# EAGLE design laminadora (EAGLE 9.6.2)

## Sheet 1 of 4
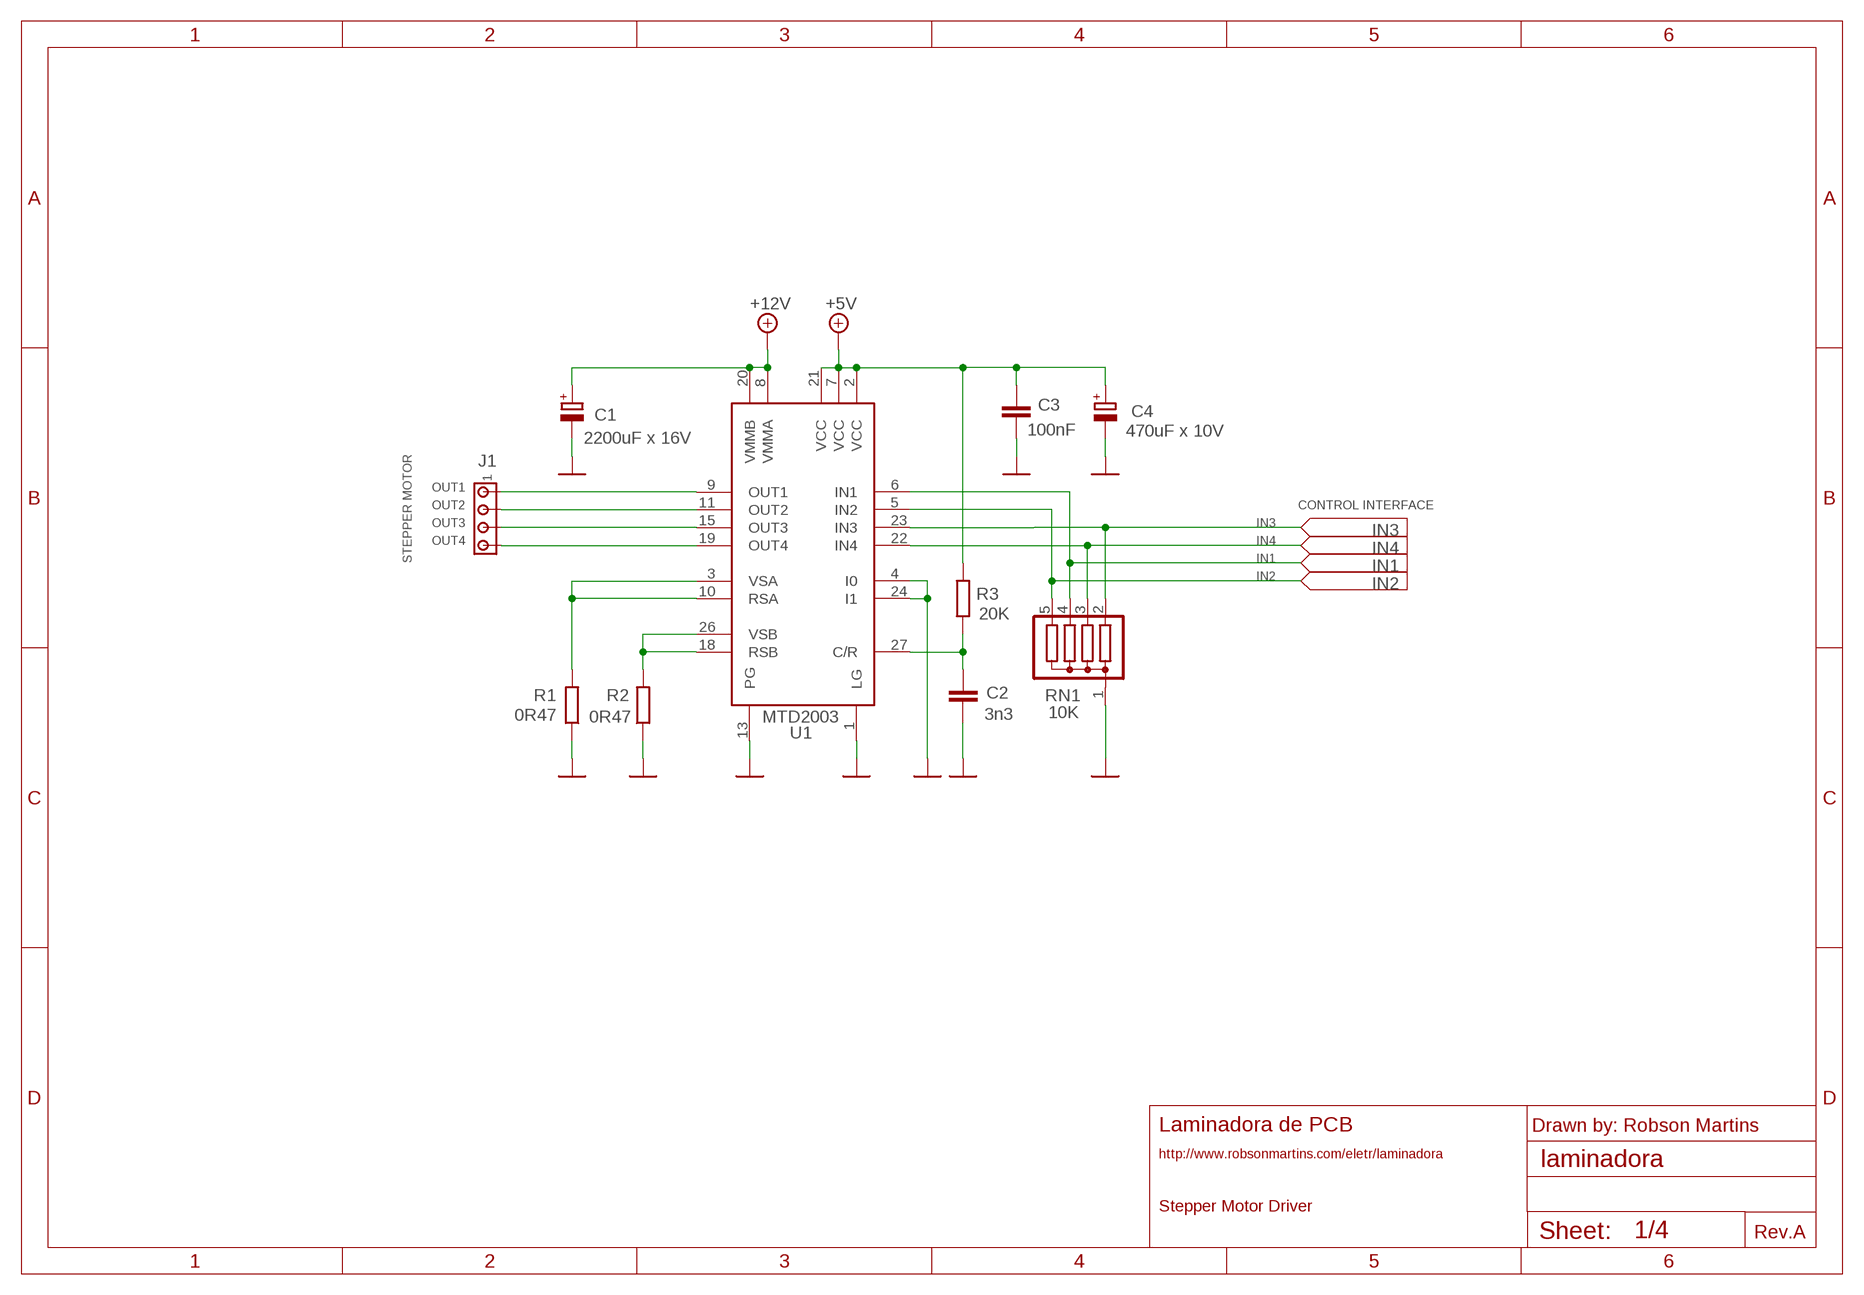
[diagram p0: schematic, sheet 1]

### Parts
C1  2200uF x 16V  CPOL-EUE5-13  [E5-13]
C2  3n3  C-EU050-025X075  [C050-025X075]
C3  100nF  C-EU050-025X075  [C050-025X075]
C4  470uF x 10V  CPOL-EUE5-8.5  [E5-8,5]
J1  A20-04  [A20-04]
R1  0R47  R-EU_0309/12  [0309/12]
R2  0R47  R-EU_0309/12  [0309/12]
R3  20K  R-EU_0207/10  [0207/10]
RN1  10K  G04R  [SIL5]
U1  MTD2003  MTD2003ZIP27SINK  [ZIP27SINK]

### Nets
+5V: C3.1 C4.+ R3.2 U1.2(VCC) U1.7(VCC) U1.21(VCC) ; also sheet 2,3,4
+12V: C1.+ U1.8(VMMA) U1.20(VMMB) ; also sheet 4
CR: C2.1 R3.1 U1.27(C/R)
GND: C1.- C2.2 C3.2 C4.- R1.1 R2.1 RN1.1 U1.1(LG) U1.4(I0) U1.13(PG) U1.24(I1) ; also sheet 2,3,4
IN1: RN1.4 U1.6(IN1) ; also sheet 2
IN2: RN1.5 U1.5(IN2) ; also sheet 2
IN3: RN1.2 U1.23(IN3) ; also sheet 2
IN4: RN1.3 U1.22(IN4) ; also sheet 2
OUT1: J1.1 U1.9(OUT1)
OUT2: J1.2 U1.11(OUT2)
OUT3: J1.3 U1.15(OUT3)
OUT4: J1.4 U1.19(OUT4)
SA: R1.2 U1.3(VSA) U1.10(RSA)
SB: R2.2 U1.18(RSB) U1.26(VSB)

### Notes on the sheet
- CONTROL INTERFACE
- STEPPER MOTOR
- Laminadora de PCB | Drawn by: Robson Martins
- http://www.robsonmartins.com/eletr/laminadora
- Stepper Motor Driver
- Rev.A

## Sheet 2 of 4
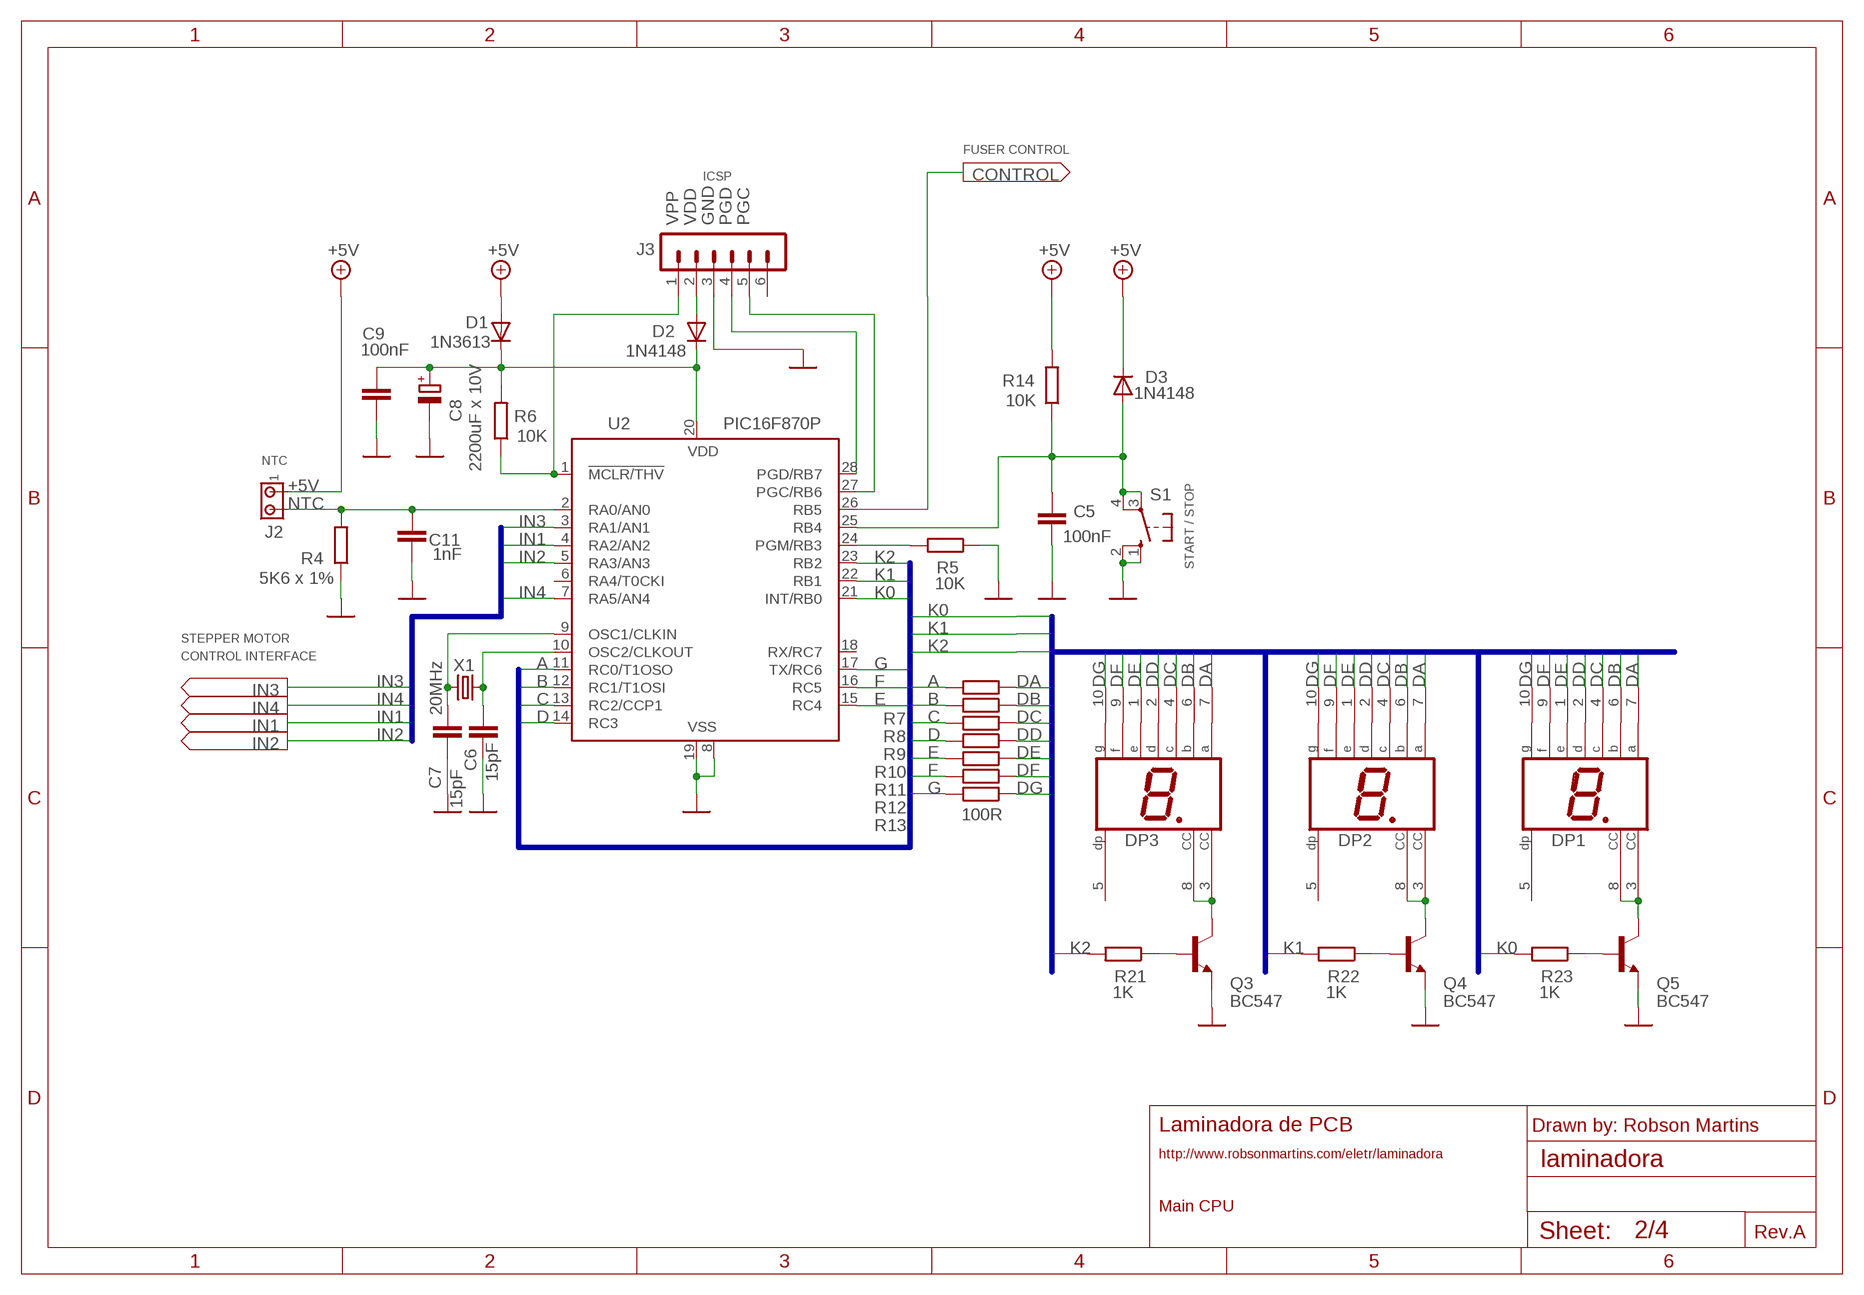
[diagram p1: schematic, sheet 2]

### Parts
C5  100nF  C-EU050-025X075  [C050-025X075]
C6  15pF  C-EU025-025X050  [C025-025X050]
C7  15pF  C-EU025-025X050  [C025-025X050]
C8  2200uF x 10V  CPOL-EUE5-13  [E5-13]
C9  100nF  C-EU050-025X075  [C050-025X075]
C11  1nF  C-EU025-025X050  [C025-025X050]
D1  1N3613  1N4148DO35-7  [DO35-7]
D2  1N4148  1N4148DO35-7  [DO35-7]
D3  1N4148  1N4148DO35-7  [DO35-7]
DP1  HD-H103  [HDSP-M]
DP2  HD-H103  [HDSP-M]
DP3  HD-H103  [HDSP-M]
J2  A20-04  MTA02-100  [10X02MTA]
J3  MA06-1  [MA06-1]
Q3  BC547  [TO92]
Q4  BC547  [TO92]
Q5  BC547  [TO92]
R4  5K6 x 1%  R-EU_0207/10  [0207/10]
R5  10K  R-EU_0207/10  [0207/10]
R6  10K  R-EU_0207/10  [0207/10]
R7  100R  R-EU_0207/10  [0207/10]
R8  100R  R-EU_0207/10  [0207/10]
R9  100R  R-EU_0207/10  [0207/10]
R10  100R  R-EU_0207/10  [0207/10]
R11  100R  R-EU_0207/10  [0207/10]
R12  100R  R-EU_0207/10  [0207/10]
R13  100R  R-EU_0207/10  [0207/10]
R14  10K  R-EU_0207/10  [0207/10]
R21  1K  R-EU_0207/10  [0207/10]
R22  1K  R-EU_0207/10  [0207/10]
R23  1K  R-EU_0207/10  [0207/10]
S1  10-XX  [B3F-10XX]
U2  PIC16F870P  [DIL28-3]
X1  20MHz  CRYSTALHC49U-V  [HC49U-V]

### Nets
+5V: D1.A D3.C J2.1 R14.2 ; also sheet 1,3,4
A: R7.2 U2.11(RC0/T1OSO)
B: R8.2 U2.12(RC1/T1OSI)
C: R9.2 U2.13(RC2/CCP1)
CONTROL: U2.26(RB5) ; also sheet 3
D: R10.2 U2.14(RC3)
DA: DP1.7(A) DP2.7(A) DP3.7(A) R7.1
DB: DP1.6(B) DP2.6(B) DP3.6(B) R8.1
DC: DP1.4(C) DP2.4(C) DP3.4(C) R9.1
DD: DP1.2(D) DP2.2(D) DP3.2(D) R10.1
DE: DP1.1(E) DP2.1(E) DP3.1(E) R11.1
DF: DP1.9(F) DP2.9(F) DP3.9(F) R12.1
DG: DP1.10(G) DP2.10(G) DP3.10(G) R13.1
E: R11.2 U2.15(RC4)
F: R12.2 U2.16(RC5)
G: R13.2 U2.17(TX/RC6)
GND: C5.2 C6.2 C7.2 C8.- C9.2 C11.2 J3.3 Q3.1(E) Q4.1(E) Q5.1(E) R4.1 R5.1 S1.1(S) S1.2(S1) U2.8(VSS) U2.19(VSS) ; also sheet 1,3,4
IN1: U2.4(RA2/AN2) ; also sheet 1
IN2: U2.5(RA3/AN3) ; also sheet 1
IN3: U2.3(RA1/AN1) ; also sheet 1
IN4: U2.7(RA5/AN4) ; also sheet 1
K0: R23.2 U2.21(INT/RB0)
K1: R22.2 U2.22(RB1)
K2: R21.2 U2.23(RB2)
N$1: DP3.3(CC) DP3.8(CC) Q3.3(C)
N$2: DP2.3(CC) DP2.8(CC) Q4.3(C)
N$3: DP1.3(CC) DP1.8(CC) Q5.3(C)
N$5: Q5.2(B) R23.1
N$6: Q4.2(B) R22.1
N$9: Q3.2(B) R21.1
NTC: C11.1 J2.2 R4.2 U2.2(RA0/AN0)
PGC: J3.5 U2.27(PGC/RB6)
PGD: J3.4 U2.28(PGD/RB7)
PGM: R5.2 U2.24(PGM/RB3)
START_STOP: C5.1 D3.A R14.1 S1.3(P) S1.4(P1) U2.25(RB4)
VDD: D2.A J3.2
VDD_MICRO: C8.+ C9.1 D1.C D2.C R6.2 U2.20(VDD)
VPP: J3.1 R6.1 U2.1(!MCLR/THV)
XTAL1: C7.1 U2.9(OSC1/CLKIN) X1.2
XTAL2: C6.1 U2.10(OSC2/CLKOUT) X1.1
Unconnected: DP1.5(DP) DP2.5(DP) DP3.5(DP) J3.6 U2.6(RA4/T0CKI) U2.18(RX/RC7)

### Buses
BUS_MICRO_DP
BUS_DP
BUS_MICRO_SM

### Notes on the sheet
- FUSER CONTROL
- ICSP
- NTC
- START / STOP
- STEPPER MOTOR
- CONTROL INTERFACE
- Laminadora de PCB | Drawn by: Robson Martins
- http://www.robsonmartins.com/eletr/laminadora
- Main CPU
- Rev.A

## Sheet 3 of 4
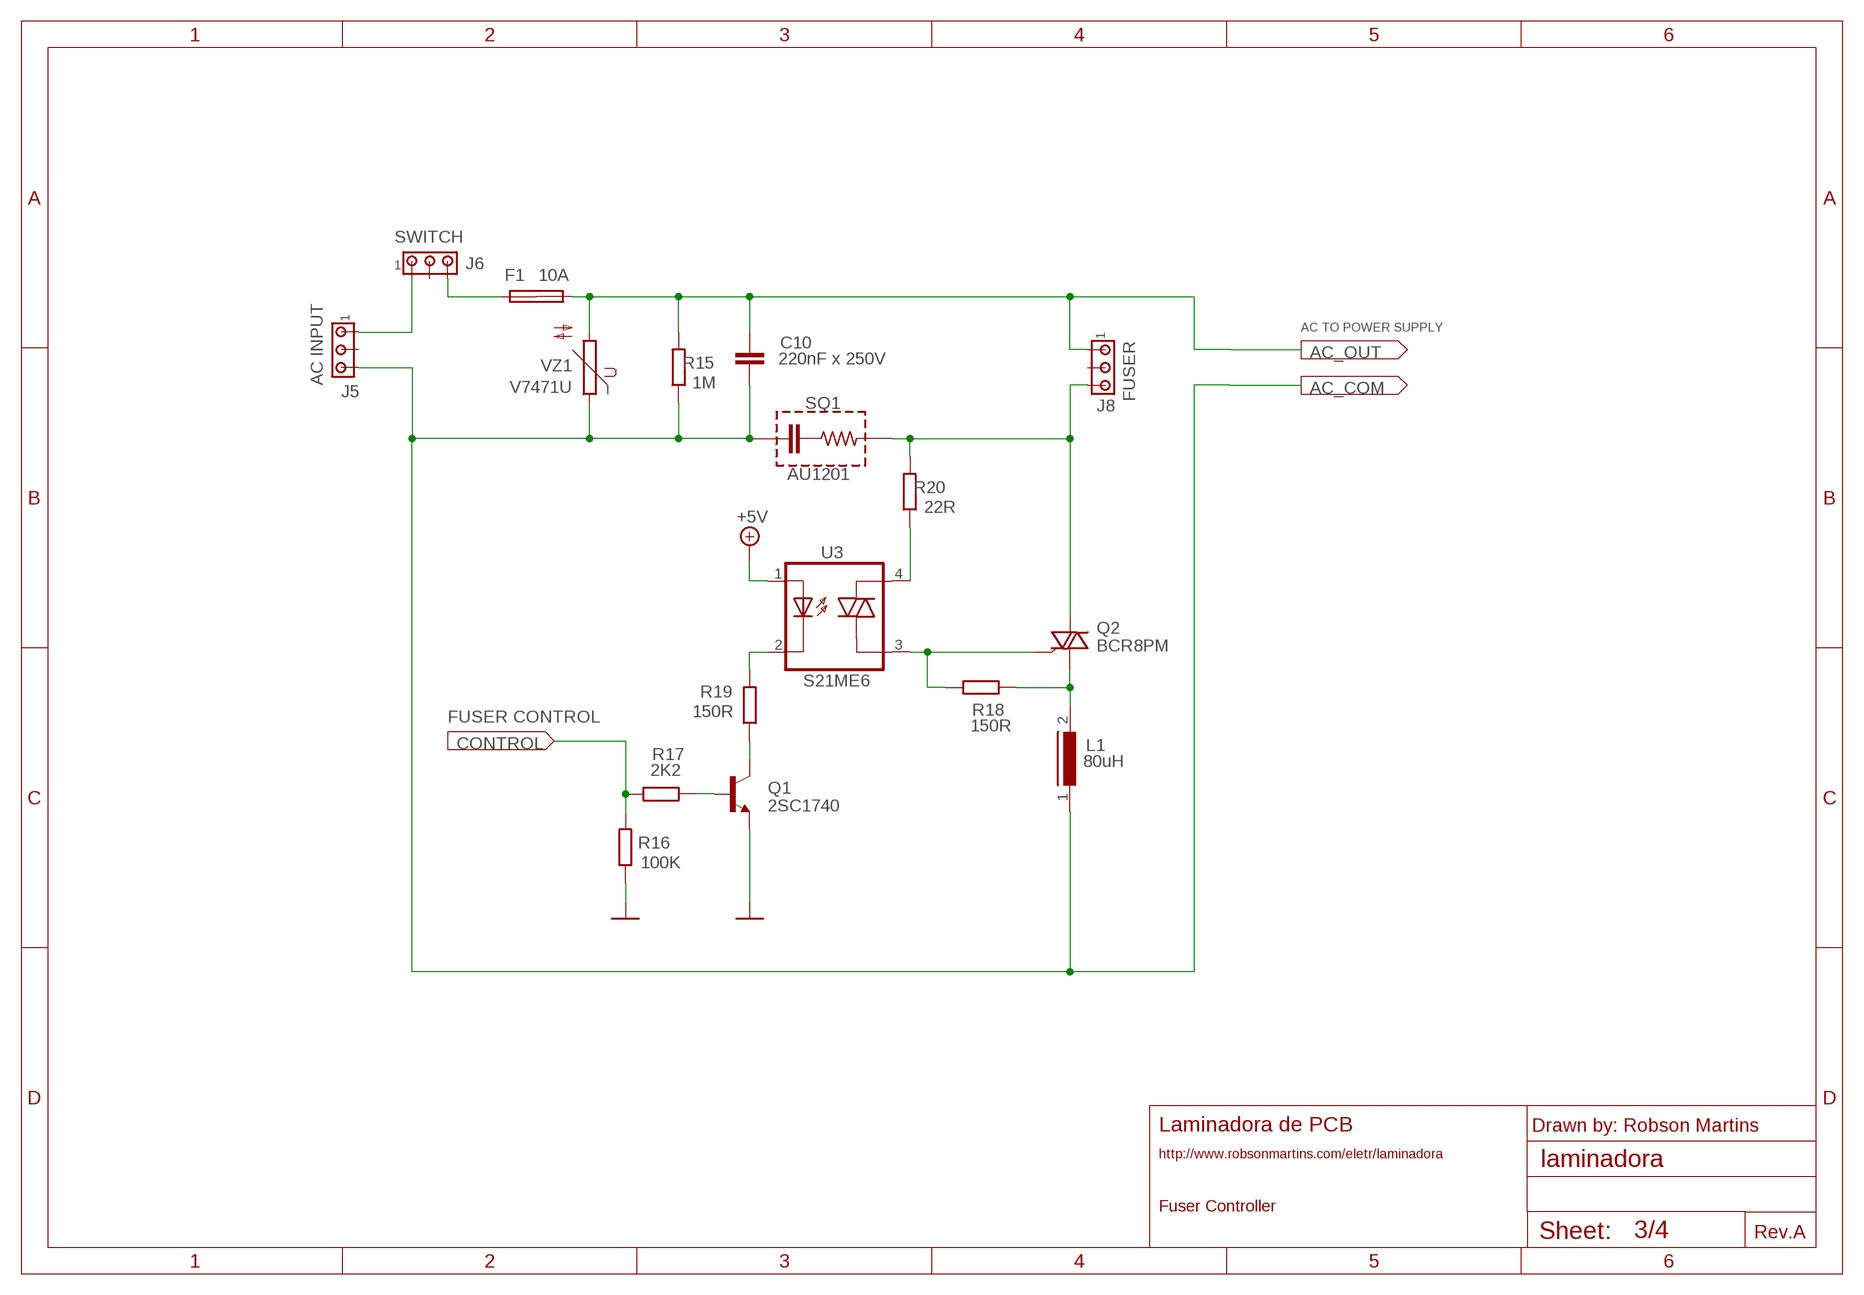
[diagram p2: schematic, sheet 3]

### Parts
C10  220nF x 250V  C-EU225-108X268  [C225-108X268]
F1  10A  SHK20L  [SHK20L]
J5  794681-2  MTA03-156  [1X3MTA]
J6  794681-2  MTA03-156  [1X3MTA]
J8  794681-2  MTA03-156  [1X3MTA]
L1  80uH  A26GFC  [A26GFC]
Q1  2SC1740  [TO92-ECB]
Q2  BCR8PM  BCR8PMTO220BVSINK  [TO220BVSINK]
R15  1M  R-EU_0207/10  [0207/10]
R16  100K  R-EU_0207/10  [0207/10]
R17  2K2  R-EU_0207/10  [0207/10]
R18  150R  R-EU_0207/10  [0207/10]
R19  150R  R-EU_0207/10  [0207/10]
R20  22R  R-EU_0207/10  [0207/10]
SQ1  AU1201  [AU]
U3  S21ME6  [DIL4]
VZ1  V7471U  S05K17  [S05K17]

### Nets
+5V: U3.1(A) ; also sheet 1,2,4
AC_COM: C10.2 J5.3 L1.1 R15.1 SQ1.1 VZ1.1 ; also sheet 4
AC_FUSER: J8.3 Q2.T2(A2) R20.2 SQ1.2
AC_IN: J5.1 J6.1
AC_OUT: C10.1 F1.2A J8.1 R15.2 VZ1.2 ; also sheet 4
AC_SW: F1.1A J6.3
CONTROL: R16.2 R17.2 ; also sheet 2
GATE: Q2.G R18.2 U3.3(A1)
GND: Q1.E R16.1 ; also sheet 1,2,4
N$4: R20.1 U3.4(A2)
N$7: L1.2 Q2.T1(A1) R18.1
N$8: R19.2 U3.2(C)
N$10: Q1.C R19.1
N$11: Q1.B R17.1
Unconnected: F1.1B F1.2B J5.2 J6.2 J8.2

### Notes on the sheet
- SWITCH
- AC TO POWER SUPPLY
- FUSER
- AC INPUT
- FUSER CONTROL
- Laminadora de PCB | Drawn by: Robson Martins
- http://www.robsonmartins.com/eletr/laminadora
- Fuser Controller
- Rev.A

## Sheet 4 of 4
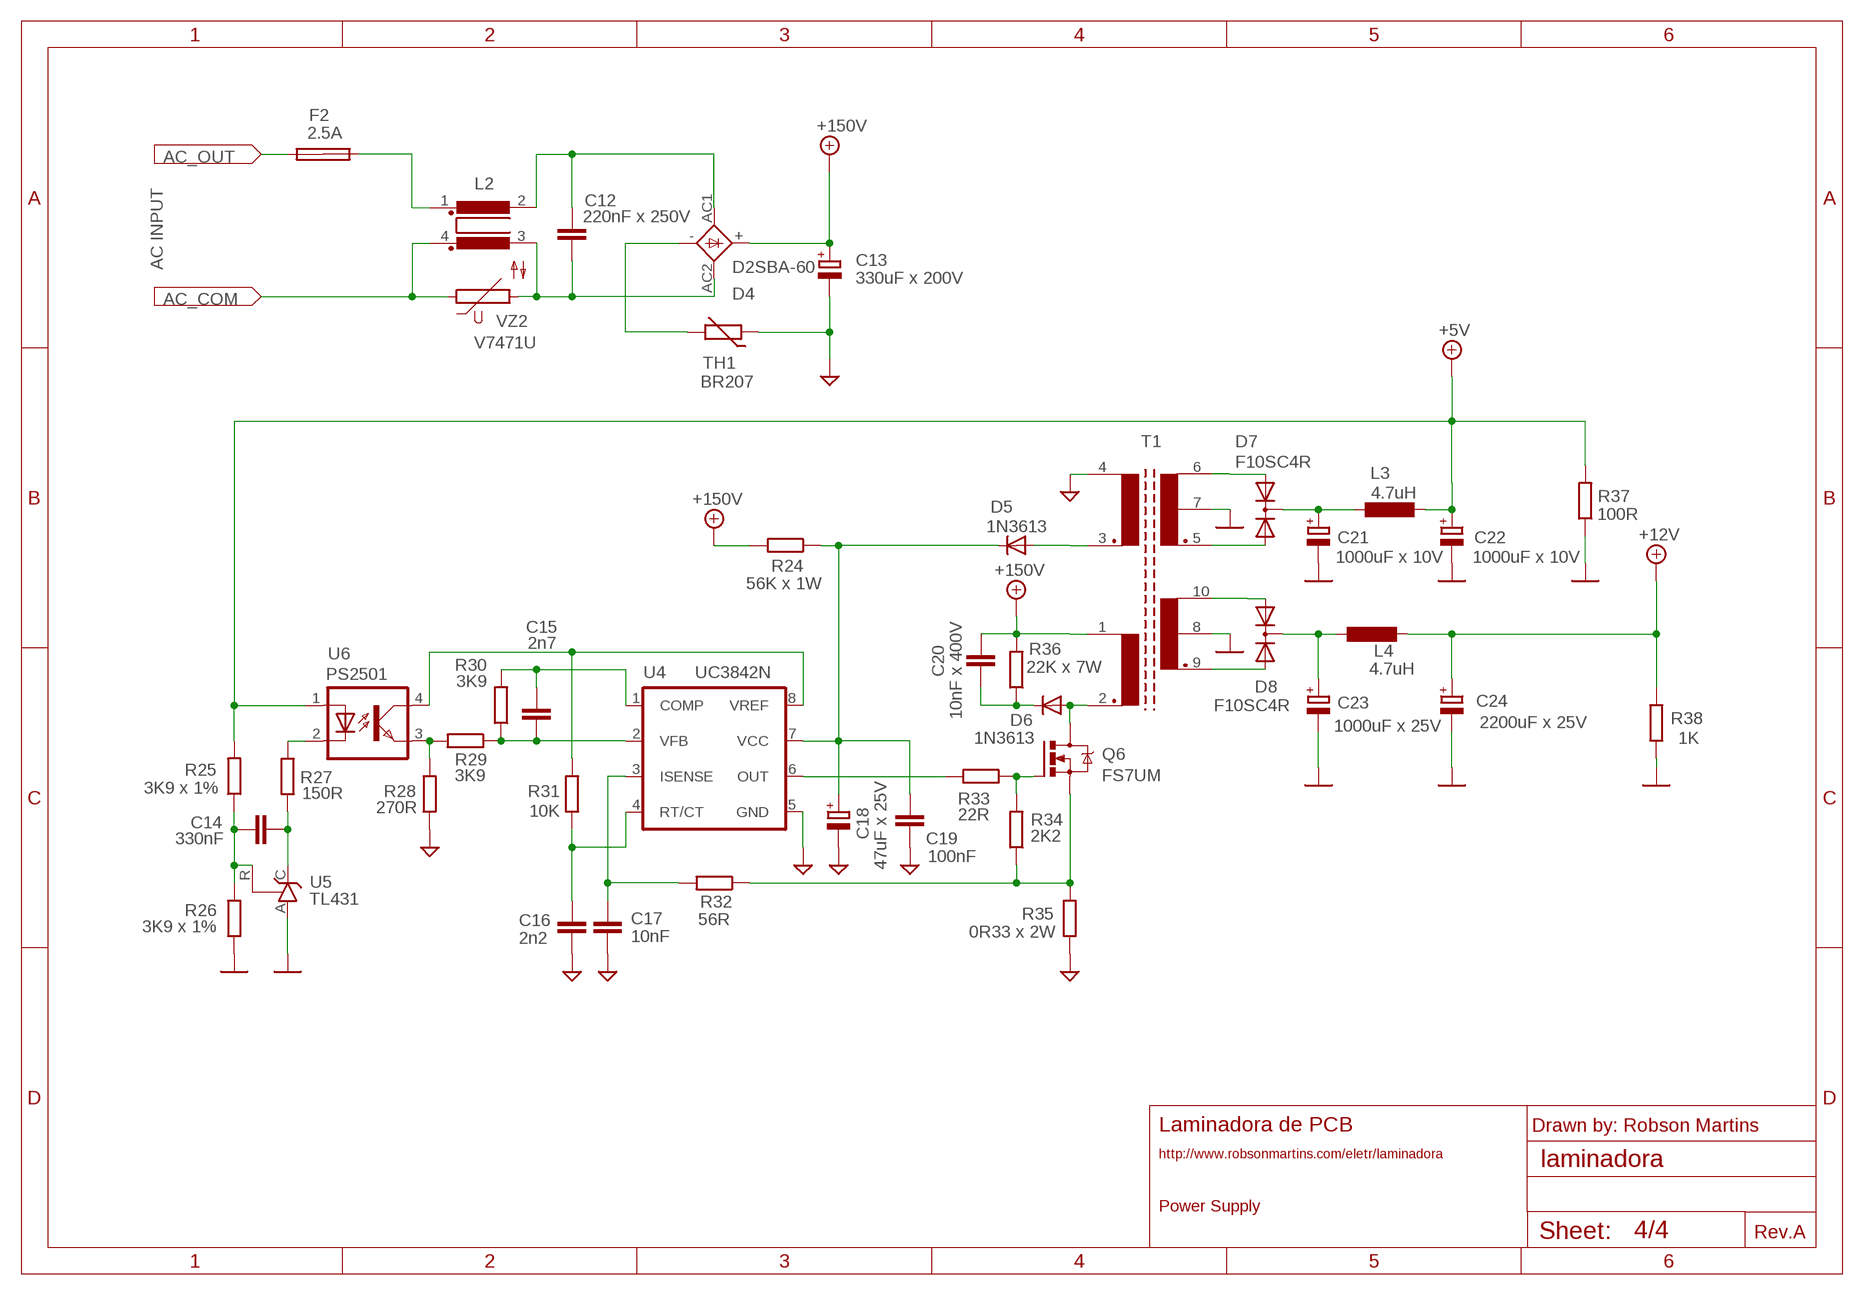
[diagram p3: schematic, sheet 4]

### Parts
C12  220nF x 250V  C-EU225-108X268  [C225-108X268]
C13  330uF x 200V  CPOL-EUE10-22.5  [EB22,5D]
C14  330nF  C-EU075-042X103  [C075-042X103]
C15  2n7  C-EU050-030X075  [C050-030X075]
C16  2n2  C-EU050-030X075  [C050-030X075]
C17  10nF  C-EU050-030X075  [C050-030X075]
C18  47uF x 25V  CPOL-EUE5-6  [E5-6]
C19  100nF  C-EU050-030X075  [C050-030X075]
C20  10nF x 400V  C-EU102-043X133  [C102-043X133]
C21  1000uF x 10V  CPOL-EUE5-10.5  [E5-10,5]
C22  1000uF x 10V  CPOL-EUE5-10.5  [E5-10,5]
C23  1000uF x 25V  CPOL-EUE5-13  [E5-13]
C24  2200uF x 25V  CPOL-EUE5-13  [E5-13]
D4  D2SBA-60  FBU4  [FBU4]
D5  1N3613  1N4148DO35-7  [DO35-7]
D6  1N3613  1N4148DO35-7  [DO35-7]
D7  F10SC4R  FEP16AT  [TO220ABS]
D8  F10SC4R  FEP16AT  [TO220ABS]
F2  2.5A  SHK20L  [SHK20L]
L2  MFE  [MFE]
L3  4.7uH  L-EU6000-XXX-RC  [6000-XXXX-RC]
L4  4.7uH  L-EU6000-XXX-RC  [6000-XXXX-RC]
Q6  FS7UM  IRF540  [TO220BV]
R24  56K x 1W  R-EU_0309/12  [0309/12]
R25  3K9 x 1%  R-EU_0207/10  [0207/10]
R26  3K9 x 1%  R-EU_0207/10  [0207/10]
R27  150R  R-EU_0207/10  [0207/10]
R28  270R  R-EU_0207/10  [0207/10]
R29  3K9  R-EU_0207/10  [0207/10]
R30  3K9  R-EU_0207/10  [0207/10]
R31  10K  R-EU_0207/10  [0207/10]
R32  56R  R-EU_0207/10  [0207/10]
R33  22R  R-EU_0207/10  [0207/10]
R34  2K2  R-EU_0207/10  [0207/10]
R35  0R33 x 2W  R-EU_0411/15  [0411/15]
R36  22K x 7W  R-EU_0617/5V  [0617V]
R37  100R  R-EU_0207/10  [0207/10]
R38  1K  R-EU_0207/10  [0207/10]
T1  SK69ABD2  [SK69ABD2]
TH1  BR207  THERMISTOR-7,5  [R-7,5]
U4  UC3842N  [DIL08]
U5  TL431  TL431CLP  [TO92-CLP]
U6  PS2501  PC817  [DIL04]
VZ2  V7471U  S05K17  [S05K17]

### Nets
5VNR: C21.+ D7.C L3.1
12VNR: C23.+ D8.C L4.1
+5V: C22.+ L3.2 R25.2 R37.2 U6.1(A) ; also sheet 1,2,3
+12V: C24.+ L4.2 R38.2 ; also sheet 1
+150V: C13.+ C20.1 D4.+ R24.2 R36.2 T1.1
AC_COM: L2.4 VZ2.1 ; also sheet 3
AC_OUT: F2.1A ; also sheet 3
AGND: C13.- C16.2 C17.2 C18.- C19.2 R28.1 R35.1 T1.4 TH1.1 U4.5(GND)
GND: C21.- C22.- C23.- C24.- R26.1 R37.1 R38.1 T1.7 T1.8 U5.A ; also sheet 1,2,3
N$14: F2.2A L2.1
N$25: R27.1 U6.2(C)
N$27: R28.2 R29.2 U6.3(EMIT)
N$30: C14.2 R27.2 U5.C
N$31: C14.1 R25.1 R26.2 U5.R
N$33: D7.A1 T1.6
N$35: C20.2 D6.C R36.1
N$36: D5.A T1.3
N$37: D7.A2 T1.5
N$38: D8.A1 T1.10
N$39: D8.A2 T1.9
PWR_16VCC: C18.+ C19.1 D5.C R24.1 U4.7(VCC)
PWR_AC1: C12.1 D4.AC1(AC2) L2.2
PWR_AC2: C12.2 D4.AC2(AC1) L2.3 VZ2.2
PWR_COMP: C15.1 R30.2 U4.1(COMP)
PWR_D_FET: D6.A Q6.D T1.2
PWR_FET_OUT: R33.2 U4.6(OUT)
PWR_G_FET: Q6.G R33.1 R34.2
PWR_ISENSE: C17.1 R32.2 U4.3(ISENSE)
PWR_RTCT: C16.1 R31.1 U4.4(RT/CT)
PWR_S_FET: Q6.S R32.1 R34.1 R35.2
PWR_VFB: C15.2 R29.1 R30.1 U4.2(VFB)
PWR_VNEG: D4.- TH1.2
PWR_VREF: R31.2 U4.8(VREF) U6.4(COL)
Unconnected: F2.1B F2.2B

### Notes on the sheet
- AC INPUT
- Laminadora de PCB | Drawn by: Robson Martins
- http://www.robsonmartins.com/eletr/laminadora
- Power Supply
- Rev.A

## Library data of the parts
C1 C4 C8 C13 C18 C21-C24 = rcl:CPOL-EU: POLARIZED CAPACITOR, European symbol
C2 C3 C5-C7 C9-C12 C14-C17 C19 C20 = rcl:C-EU: CAPACITOR, European symbol
D1-D3 D5 D6 = diode:1N4148: DIODE high speed (Philips)
D4 = rectifier:FBU4: FAGOR RECTIFIER grid 3 x 5 mm
D7 D8 = diode:FEP16AT: DIODE dual ultra-fast recovery rectifier, common cathode
DP1-DP3 = display-hp:HD-H103: LED DISPLAY 1-character 7 segment, decimal point right; OC_FARNELL: unknown; OC_NEWARK: unknown
F1 F2 = fuse:SHK20L: FUSE HOLDER 5 x 20 mm, SH contact, SHH1 Schukat, E1073 Buerklin; OC_FARNELL: unknown; OC_NEWARK: unknown
J1 = con-amp:A20-04
J2 = con-amp:MTA02-100: AMP connector; OC_FARNELL: unknown; OC_NEWARK: unknown
J3 = con-lstb:MA06-1: PIN HEADER; OC_FARNELL: unknown; OC_NEWARK: unknown
J5 J6 J8 = con-amp:MTA03-156: AMP connector; OC_FARNELL: unknown; OC_NEWARK: unknown
L1 = inductors:A26GFC: INDUCTOR
L2 = inductors:MFE: FILTER
L3 L4 = rcl:L-EU: INDUCTOR, European symbol
Q1 = transistor:2SC1740: NPN Silicon Epitaxial Planar Transistor Source: SEMTECH ELECTRONICS LTD. 2SC1740.pdf
Q2 = mitsubishi:BCR8PM
Q3-Q5 = transistor:BC547: NPN TRANSISTOR
Q6 = transistor-power:IRF540: HEXFET Power MOSFET
R1-R38 = resistor:R-EU_: RESISTOR, European symbol
RN1 = resistor-sil:G04R: SIL RESISTOR; OC_FARNELL: unknown; OC_NEWARK: unknown
S1 = switch-omron:10-XX: OMRON SWITCH; MPN: B3F-1000; OC_FARNELL: 176432; OC_NEWARK: 36M3542
SQ1 = okaya:AU1201
T1 = trafo:SK69ABD2: Ferrite SMPS Transformer
TH1 = varistor:THERMISTOR: THERMISTOR
U1 = shindengen:MTD2003: Stepping Motor Driver IC (Datasheet <http://www.shindengen.co.jp/product_e/semi/list_detail_NEW.php?category_id=07&sub_id=01&product_id=MTD2003B&id=6>).
U2 = microchip:PIC16*870: MICROCONTROLLER flash type; MF: MICROCHIP; MPN: PIC16F870-I/SP; OC_FARNELL: 9760954; OC_NEWARK: 19C7275
U3 = sharp:S21ME6
U4 = v-reg:UC384*: SMPS Controller Source: http://www.fairchildsemi.com/ds/UC/UC3843.pdf
U5 = v-reg:TL431CLP: VOLTAGE REGULATOR
U6 = optocoupler:PC817: SHARP OPTO COUPLER; MPN: PC817X4J000F; OC_FARNELL: 9707727; OC_NEWARK: 97K7059
VZ1 VZ2 = varistor:S05K17: VARISTOR
X1 = crystal:CRYSTAL: CRYSTAL; OC_FARNELL: 1666969; OC_NEWARK: unknown

## Board
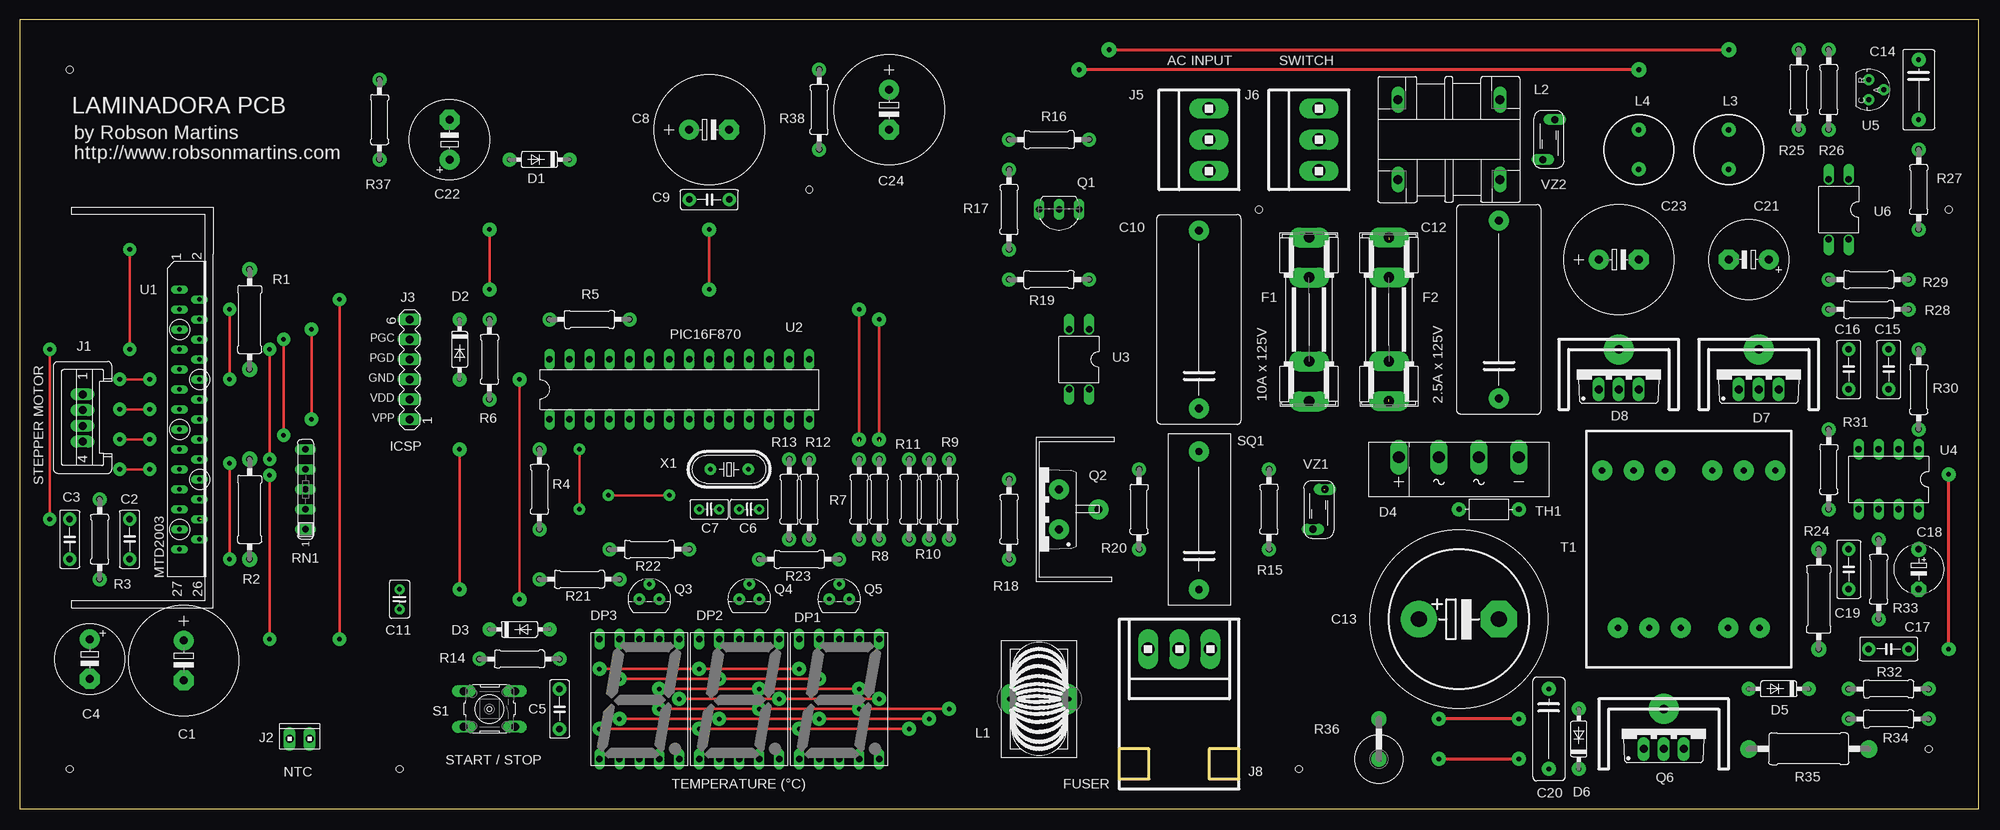
[diagram p4: board, top side]
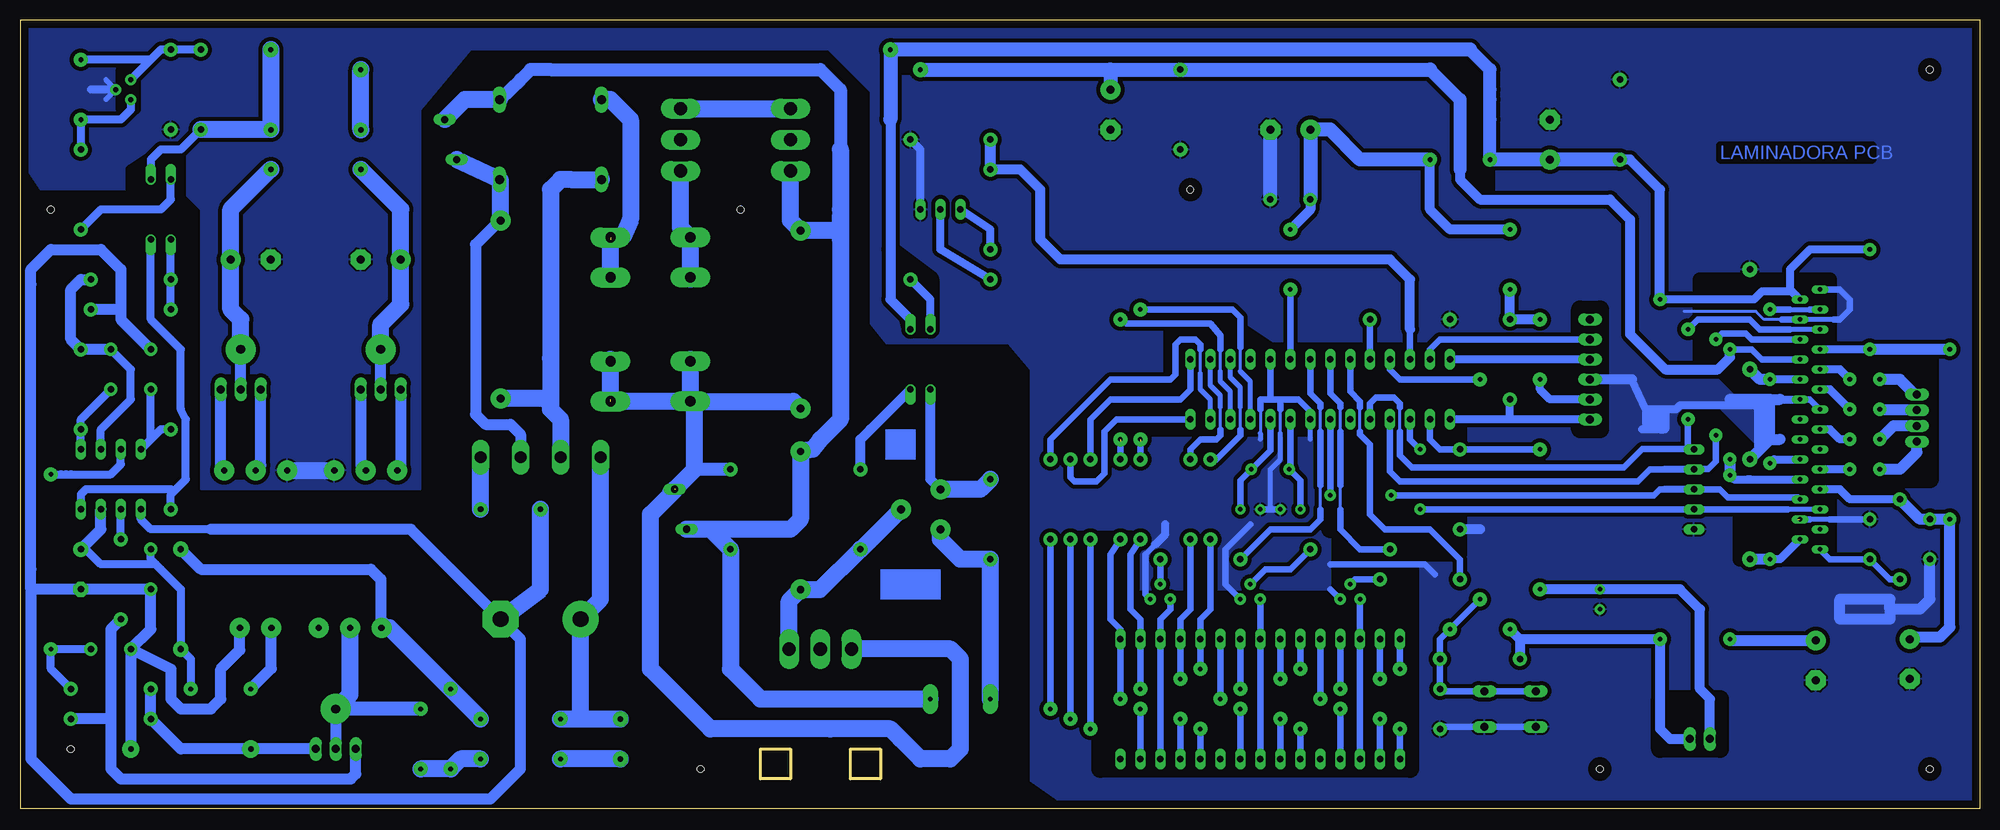
[diagram p5: board, bottom side, seen from below]

Size 248.94 x 100.33 mm. Coordinates in mm from the lower left corner, seen from the top.
Outline: 0,100.33 0,0 248.94,0 248.91,100.33 0,100.33
Outline: 139.7,7.62 139.7,3.81 143.51,3.81 143.51,7.62 139.7,7.62
Outline: 151.13,7.62 151.13,3.81 154.94,3.81 154.94,7.62 151.13,7.62
Copper layers (1*16): Top 0.035mm / dielectric 1.5mm / Bottom 0.035mm
Design rules "default": minimum track width 10mil, minimum drill 24mil, track to track 8mil, track to pad 8mil, pad to pad 8mil, via to via 8mil, smd to smd 8mil, copper to edge 40mil, drill to drill 8mil, minimum pad ring 10mil, minimum via ring 8mil, stop-mask expansion 4mil, vias tented up to drill 0mil, thermal gap 10mil
Holes 0.9 mm at 162.56,5.08 6.35,5.08 157.48,76.2 6.35,93.98 100.33,78.74 48.26,5.08 245.11,76.2 242.57,7.62
bKeepout: 3 lines
bRestrict: area 19.1,31.8 to 35.6,67.3; area 66,32.4 to 110.5,61; area 72.4,5.1 to 115.6,47; area 133.3,61 to 138.4,71.1; area 48.3,48.3 to 50.8,63.5; area 33,7.6 to 40.6,14; area 6.3,41.9 to 17.8,57.2; area 29.2,43.2 to 36.8,50.8; area 62.2,77.5 to 138.4,96.5; area 200.7,42.5 to 205.7,54.6; area 218.4,42.5 to 223.5,54.6; area 228.6,77.5 to 234.9,83.8; 1 more areas

### Footprints (pad centres in the part's own frame; a part is rotated, then mirrored left to right if it is on the bottom)
E5-13 = drill 1.016 pad 2.54 round: + -2.54,0 | drill 1.016 pad 2.54 octagon: - 2.54,0
C050-025X075 = drill 0.813 pad 1.676 round: 1 -2.54,0; 2 2.54,0
E5-8,5 = drill 1.016 pad 2.54 round: + -2.54,0 | drill 1.016 pad 2.54 octagon: - 2.54,0
C025-025X050 = drill 0.6 pad 1.27 round: 1 -1.27,0; 2 1.27,0
C225-108X268 = drill 1.016 pad 2.54 round: 1 -11.303,0; 2 11.303,0
EB22,5D = drill 2.007 pad 4.597 round: + -5.08,0 | drill 2.007 pad 4.597 octagon: - 5.08,0
C075-042X103 = drill 0.6 pad 1.778 round: 1 -3.81,0; 2 3.81,0
C050-030X075 = drill 0.813 pad 1.676 round: 1 -2.54,0; 2 2.54,0
E5-6 = drill 0.813 pad 1.905 round: + -2.54,0 | drill 0.813 pad 1.905 octagon: - 2.54,0
C102-043X133 = drill 0.6 pad 1.778 round: 1 -5.08,0; 2 5.08,0
E5-10,5 = drill 1.016 pad 2.54 round: + -2.54,0 | drill 1.016 pad 2.54 octagon: - 2.54,0
DO35-7 = drill 0.6 pad 1.778 round: A 3.81,0; C -3.81,0
FBU4 = drill 1.499 long: + 7.62,-1.54; - -7.62,-1.54; AC1 2.54,-1.54; AC2 -2.54,-1.54
TO220ABS = drill 1.016 long: A1 -2.54,-2.54; A2 2.54,-2.54; C 0,-2.54
HDSP-M = drill 0.813 long: 1 -5.08,-7.62; 2 -2.54,-7.62; 3 0,-7.62; 4 2.54,-7.62; 5 5.08,-7.62; 6 5.08,7.62; 7 2.54,7.62; 8 0,7.62; 9 -2.54,7.62; 10 -5.08,7.62
SHK20L = drill 1.321 pad 2.54 long: 1A -10.414,0; 1B -5.334,0; 2A 10.414,0; 2B 5.334,0
A20-04 = drill 1.016 long: 1 6.5,0; 2 4.5,0; 3 2.5,0; 4 0.5,0
10X02MTA = drill 1.016 long: 1 1.27,0; 2 -1.27,0
MA06-1 = drill 1.016 long: 1 -6.35,0; 2 -3.81,0; 3 -1.27,0; 4 1.27,0; 5 3.81,0; 6 6.35,0
1X3MTA = drill 1.676 long: 1 3.937,0; 2 -0.025,0; 3 -3.988,0
A26GFC = drill 0.6 pad 1.93 long: 1 0,3.81; 2 0,-3.81
MFE = drill 1.118 long: 1 6.477,-5.08; 2 6.477,5.08; 3 -6.477,5.08; 4 -6.477,-5.08
6000-XXXX-RC = drill 0.7 pad 1.778 round: 1 -2.5,0; 2 2.5,0
TO92-ECB = drill 0.813 long: B 2.54,0; C 0,0; E -2.54,0
TO220BVSINK = drill 1.016 pad 2.54 round: G 2.54,-2.54; T1 -2.54,-2.54; T2 0,-7.54
TO92 = drill 0.6 pad 1.422 round: 1 1.27,0; 2 0,1.905; 3 -1.27,0
TO220BV = drill 1.016 long: D 0,-2.54; G -2.54,-2.54; S 2.54,-2.54
0309/12 = drill 0.8 pad 1.93 round: 1 -6.35,0; 2 6.35,0
0207/10 = drill 0.813 pad 1.778 round: 1 -5.08,0; 2 5.08,0
0411/15 = drill 0.7 pad 2.184 round: 1 -7.62,0; 2 7.62,0
0617V = drill 0.7 pad 1.93 round: 1 -2.54,0; 2 2.54,0
SIL5 = drill 0.813 long: 1 -5.08,0; 2 -2.54,0; 3 0,0; 4 2.54,0; 5 5.08,0
B3F-10XX = drill 1.016 long: 1 -3.251,2.261; 2 3.251,2.261; 3 -3.251,-2.261; 4 3.251,-2.261
AU = drill 0.9 pad 2.54 round: 1 8.61,0; 2 -8.95,0
SK69ABD2 = drill 0.8 pad 2.54 round: 0 -10,1; 1 -10,9; 2 -10,5; 3 -10,-5; 4 -10,-9; 5 10,-11; 6 10,-7; 7 10,-3; 8 10,3; 9 10,7; 10 10,11
R-7,5 = drill 0.7 pad 1.778 round: 1 -3.81,0; 2 3.81,0
ZIP27SINK = drill 0.6 pad 1.016 long: 1 -16.51,-1.27; 2 -15.24,1.27; 3 -13.97,-1.27; 4 -12.7,1.27; 5 -11.43,-1.27; 6 -10.16,1.27; 7 -8.89,-1.27; 8 -7.62,1.27; 9 -6.35,-1.27; 10 -5.08,1.27; 11 -3.81,-1.27; 12 -2.54,1.27; 13 -1.27,-1.27; 14 0,1.27; 15 1.27,-1.27; 16 2.54,1.27; 17 3.81,-1.27; 18 5.08,1.27; 19 6.35,-1.27; 20 7.62,1.27; 21 8.89,-1.27; 22 10.16,1.27; 23 11.43,-1.27; 24 12.7,1.27; 25 13.97,-1.27; 26 15.24,1.27; 27 16.51,-1.27
DIL28-3 = drill 0.813 long: 1 -16.51,-3.81; 2 -13.97,-3.81; 3 -11.43,-3.81; 4 -8.89,-3.81; 5 -6.35,-3.81; 6 -3.81,-3.81; 7 -1.27,-3.81; 8 1.27,-3.81; 9 3.81,-3.81; 10 6.35,-3.81; 11 8.89,-3.81; 12 11.43,-3.81; 13 13.97,-3.81; 14 16.51,-3.81; 15 16.51,3.81; 16 13.97,3.81; 17 11.43,3.81; 18 8.89,3.81; 19 6.35,3.81; 20 3.81,3.81; 21 1.27,3.81; 22 -1.27,3.81; 23 -3.81,3.81; 24 -6.35,3.81; 25 -8.89,3.81; 26 -11.43,3.81; 27 -13.97,3.81; 28 -16.51,3.81
DIL4 = drill 0.813 offset: 1 -1.27,-3.81; 2 1.27,-3.81; 3 1.27,3.81; 4 -1.27,3.81
DIL08 = drill 0.813 long: 1 -3.81,-3.81; 2 -1.27,-3.81; 3 1.27,-3.81; 4 3.81,-3.81; 5 3.81,3.81; 6 1.27,3.81; 7 -1.27,3.81; 8 -3.81,3.81
TO92-CLP = drill 0.6 pad 1.422 round: A 0,1.905; C 1.27,0; R -1.27,0
DIL04 = drill 0.813 offset: 1 -1.27,-3.81; 2 1.27,-3.81; 3 1.27,3.81; 4 -1.27,3.81
S05K17 = drill 0.914 long: 1 -0.762,-2.54; 2 0.762,2.54
HC49U-V = drill 0.6 pad 1.422 round: 1 -2.413,0; 2 2.413,0

### Placement (x,y rotation side)
C1  20.86,18.86 270 top
C2  13.97,34.29 90 top
C3  6.35,34.29 270 top
C4  8.89,19.05 270 top
C5  68.58,12.7 270 top
C6  92.71,38.1 180 top
C7  87.63,38.1 0 top
C8  87.63,86.36 0 top
C9  87.63,77.47 0 top
C10  149.86,62.23 90 top
C11  48.26,26.67 270 top
C12  187.96,63.5 90 top
C13  182.88,24.13 0 top
C14  241.3,91.44 270 top
C15  237.49,55.88 90 top
C16  232.41,55.88 90 top
C17  237.49,20.32 180 top
C18  241.3,30.48 270 top
C19  232.41,30.48 270 top
C20  194.31,10.16 270 top
C21  219.71,69.85 180 top
C22  54.61,85.09 90 top
C23  203.2,69.85 0 top
C24  110.49,88.9 270 top
D1  66.04,82.55 180 top
D2  55.88,58.42 270 top
D3  63.5,22.86 0 top
D4  182.88,43.18 180 top
D5  223.52,15.24 180 top
D6  198.12,8.89 90 top
D7  220.98,55.88 0 top
D8  203.2,55.88 0 top
DP1  104.14,13.97 0 top
DP2  91.44,13.97 0 top
DP3  78.74,13.97 0 top
F1  163.83,62.23 270 top
F2  173.99,62.23 90 top
J1  8.01,46.2 90 top
J2  35.56,8.89 0 top
J3  49.53,55.88 90 top
J5  151.13,85.09 90 top
J6  165.1,85.09 90 top
J8  147.32,20.32 180 top
L1  129.54,13.97 270 top
L2  181.61,85.09 180 top
L3  217.17,83.82 90 top
L4  205.74,83.82 90 top
Q1  132.08,76.2 180 top
Q2  129.54,38.1 90 top
Q3  80.01,26.67 0 top
Q4  92.71,26.67 0 top
Q5  104.14,26.67 0 top
Q6  208.91,10.16 0 top
R1  29.21,62.23 270 top
R2  29.21,38.1 270 top
R3  10.16,34.29 90 top
R4  18K x 1%  [0207/10]  66.04,40.64 90 top
R5  72.39,62.23 0 top
R6  59.69,57.15 90 top
R7  106.68,39.37 90 top
R8  109.22,39.37 90 top
R9  118.11,39.37 90 top
R10  115.57,39.37 90 top
R11  113.03,39.37 90 top
R12  100.33,39.37 90 top
R13  97.79,39.37 90 top
R14  63.5,19.05 180 top
R15  158.75,38.1 90 top
R16  130.81,85.09 180 top
R17  125.73,76.2 90 top
R18  125.73,36.83 90 top
R19  130.81,67.31 0 top
R20  142.24,38.1 270 top
R21  71.12,29.21 180 top
R22  80.01,33.02 180 top
R23  99.06,31.75 180 top
R24  228.6,26.67 90 top
R25  226.06,91.44 270 top
R26  229.87,91.44 90 top
R27  241.3,78.74 90 top
R28  234.95,63.5 180 top
R29  234.95,67.31 180 top
R30  241.3,53.34 270 top
R31  229.87,43.18 270 top
R32  237.49,15.24 0 top
R33  236.22,29.21 90 top
R34  237.49,11.43 0 top
R35  227.33,7.62 180 top
R36  172.72,8.89 90 top
R37  45.72,87.63 270 top
R38  101.6,88.9 90 top
RN1  36.32,40.64 90 top
S1  59.69,12.7 180 top
SQ1  149.86,36.83 90 top
T1  212.09,33.02 90 top
TH1  186.69,38.1 0 top
U1  21.59,49.53 270 top
U2  83.82,53.34 0 top
U3  134.62,57.15 180 top
U4  237.49,41.91 180 top
U5  234.95,91.44 270 top
U6  231.14,76.2 180 top
VZ1  165.1,38.1 0 top
VZ2  194.31,85.09 180 top
X1  90.17,43.18 180 top

### Tracks (layer width: path | path; a pad name or v marks a point on that pad's centre or on a via)
5VNR  (via drill 1.1 pad 3.81)
  Bottom 1.422: D7.C v220.98,58.42
  Bottom 2.184: L3.1 222.25,76.24 C21.+ 222.25,63.5 220.98,62.23 v220.98,58.42
12VNR  (via drill 1.1 pad 3.81)
  Bottom 1.422: D8.C v203.2,58.42
  Bottom 2.184: v203.2,58.42 203.2,61.6 200.66,64.14 C23.+ 200.66,76.24 L4.1
+5V  (via drill 0.6 pad 1.68, 0.6 pad 1.93)
  Top 0.305: v40.64,64.77 v40.64,21.59 | v13.97,58.42 v13.97,71.12 | v3.81,36.83 v3.81,58.42
  Top 0.406: v138.43,96.52 v217.17,96.52
  Bottom 0.813: 7.62,36.83 R3.2
  Bottom 1.016: R3.2 16.51,39.37 17.78,40.64 U1.21 | v13.97,71.12 16.51,71.12 21.59,71.12 24.13,68.58 24.13,67.31 24.13,66.04 23.37,65.28 | 23.37,65.28 U1.2 | v40.64,64.77 29.21,64.77 28.7,64.77 27.69,65.79 23.88,65.79 23.37,65.28 | R25.2 228.6,83.82 231.14,83.82 232.41,82.55 232.41,81.28 U6.1 | v13.97,58.42 U1.7 v13.97,58.42
  Bottom 1.27: D1.A C22.+ R37.2 44.45,82.55 40.64,78.74 v40.64,64.77 | 58.42,21.59 R14.2 | 58.42,21.59 D3.C | 58.42,21.59 v40.64,21.59 40.64,10.16 39.37,8.89 J2.1 | 138.43,87.63 138.43,64.77 135.89,62.23 U3.1
  Bottom 1.422: R3.2 7.62,36.83 C3.1 v3.81,36.83 3.81,23.11 5.08,21.84 8.64,21.84 C4.+ | v13.97,58.42 5.08,58.42 v3.81,58.42
  Bottom 1.676: D1.A 62.23,87.63 62.23,90.17 62.23,91.44 62.23,93.98 64.77,96.52
  Bottom 1.778: 64.77,96.52 v138.43,96.52 138.43,87.63 | D1.A C22.+ R37.2 | 217.17,86.36 L3.2
  Bottom 2.184: v217.17,96.52 217.17,86.36 R25.2
+12V  (via drill 0.6 pad 1.68, 0.6 pad 1.93)
  Top 0.305: v31.75,58.42 v31.75,44.45 | v31.75,42.42 v31.75,21.59
  Top 0.406: v205.74,93.98 v134.62,93.98
  Bottom 0.813: U1.8 27.69,57.15 28.96,58.42 30.23,58.42 v31.75,58.42 | 40.01,55.9 39.99,55.88
  Bottom 1.016: U1.20 29.21,41.91 29.46,41.91 31.24,41.91 v31.75,42.42
  Bottom 1.27: v31.75,58.42 31.75,57.4 33.27,55.88 39.99,55.88 | 66.04,83.82 66.04,81.28 66.04,80.01 63.5,77.47 46.99,77.47 44.45,74.93 44.45,60.34 40.01,55.9
  Bottom 1.422: v31.75,21.59 31.56,21.4 C1.+ | v31.75,44.45 v31.75,42.42
  Bottom 1.676: 69.85,93.98 66.04,90.17 66.04,83.82 66.04,81.28
  Bottom 1.778: 69.85,93.98 R38.2 110.49,93.98 | v134.62,93.98 110.49,93.98 | 110.49,93.98 C24.+
  Bottom 2.184: L4.2 v205.74,93.98
+150V  (via drill 0.6 pad 1.78)
  Top 0.406: v190.5,11.43 v180.34,11.43
  Bottom 1.016: 203.2,23.13 T1.1
  Bottom 1.422: R24.2 226.06,30.48 204.47,30.48 203.2,29.21 203.2,23.13 T1.1 | 202.09,23.02 203.2,24.13
  Bottom 2.184: D4.+ 175.26,26.67 C13.+ 177.8,15.24 177.8,13.97 177.8,11.43 | T1.1 202.09,23.02 C20.1 v190.5,11.43 | 177.8,11.43 R36.2 | v180.34,11.43 177.8,11.43
A  (via drill 0.6 pad 1.78)  (1 unrouted)
  Top 0.305: v106.68,63.5 v106.68,46.99
  Bottom 0.406: 93.98,55.63 93.98,58.67
  Bottom 0.61: U2.11 92.71,54.36 93.98,55.63
  Bottom 0.813: R7.2 106.68,46.74 | 93.98,58.67 93.98,62.48 94.74,63.25 95,63.5 v106.68,63.5
AC_COM
  Bottom 1.676: L2.4 185.42,92.71 184.15,93.98 181.61,93.98 147.32,93.98 144.78,91.44 144.78,83.82
  Bottom 2.184: J5.3 151.13,74.8 C10.2 144.91,73.53 144.78,76.2 | 161.29,35.56 162.56,35.56 VZ1.1 | 161.29,35.56 R15.1 158.75,17.78 154.94,13.97 135.89,13.97 L1.1 | 161.29,35.56 151.13,35.56 149.86,36.83 SQ1.1 148.31,45.72 147.32,46.99 144.78,49.53 144.78,72.39 144.78,76.2 | L2.4 192.53,90.17 VZ2.1 | 144.78,83.82 144.78,76.2
AC_FUSER
  Bottom 1.676: R20.2 142.16,33.02
  Bottom 2.184: J8.3 151.31,26.43 SQ1.2 147.38,27.88 R20.2 | 142.16,33.02 Q2.T2
AC_IN
  Bottom 2.184: J6.1 J5.1
AC_OUT  (2 unrouted)
  Bottom 1.676: R15.2 163.32,43.18 | 163.32,51.31 F1.2A
  Bottom 2.184: F1.2A 150.75,51.82 C10.1 | 163.32,51.31 163.32,43.18 VZ1.2 166.37,40.13 | J8.1 130.81,20.32 129.54,19.05 129.54,15.24 129.54,7.62 130.81,6.35 134.62,6.35 137.16,8.89 138.43,10.16 146.05,10.16 161.29,10.16 168.91,17.78 168.91,37.47 165.74,40.64 | 163.83,57.15 163.83,52.07 F1.2A | F1.2A F2.1A | 173.99,52.07 173.99,57.15
AC_SW
  Bottom 2.184: J6.3 165.1,73.91 F1.1A 163.83,72.39 163.83,67.31
AGND
  Bottom 1.016: 238.76,71.12 242.57,71.12 | U4.5 233.68,36.83 232.41,35.56 227.33,35.56 224.79,35.56
  Bottom 1.422: C19.2 234.95,27.94 | C19.2 C18.- | C16.2 236.22,62.23 236.22,63.5 | C17.2 R35.1 | C17.2 232.41,22.86 C19.2 | C19.2 245.11,27.94 247.65,27.94 | 236.22,63.5 236.22,68.58 238.76,71.12 245.11,71.12 247.65,68.58 247.65,66.68 247.65,30.48 247.65,27.94 | 236.22,63.5 R28.1 | 224.79,35.56 199.39,35.56 C13.- 185.42,21.59 185.42,5.08 189.23,1.27 242.57,1.27 243.84,2.54 247.65,6.35 247.65,27.94 | T1.4 221.09,20.21 223.52,17.78 223.52,13.97 224.79,12.7 228.6,12.7 229.87,13.97 229.87,17.78 C17.2
  Bottom 2.184: TH1.1 182.88,27.94 C13.-
B  (via drill 0.6 pad 1.78)  (1 unrouted)
  Top 0.305: v109.22,62.23 v109.22,46.99
  Bottom 0.406: 96.52,55.63 96.52,58.42
  Bottom 0.61: U2.12 95.25,53.09 96.52,54.36 96.52,55.63
  Bottom 0.813: R8.2 109.22,46.74 | 96.52,58.42 96.52,60.2 97.79,61.72 108.46,61.72 v109.22,62.23
C
  Bottom 0.406: 99.06,54.86 99.06,55.37 99.06,58.42
  Bottom 0.61: U2.13 97.79,52.07 99.06,53.34 99.06,55.37
  Bottom 0.813: 99.06,58.42 99.06,58.67 99.06,59.06 99.69,59.69 101.6,59.69 102.23,59.06 102.23,55.25 102.87,54.61 105.41,54.61 110.49,54.61 118.11,46.99 R9.2
CONTROL
  Bottom 0.813: U2.26 72.39,60.96
  Bottom 1.27: R17.2 121.92,81.28 119.38,78.74 119.38,72.39 116.84,69.85 74.93,69.85 72.39,67.31 72.39,60.96
  Bottom 1.422: R17.2 R16.2
CR
  Bottom 0.813: R3.1 11.43,29.21 C2.1 19.05,31.75 U1.27
D
  Bottom 0.813: R10.2 115.57,42.16 115.06,41.66 112.52,41.66 112.27,41.66 111.51,42.42 111.25,42.67 111.25,48.01 109.73,49.53 U2.14
DA  (via drill 0.6 pad 1.78)
  Top 0.305: v81.28,15.24 v93.98,15.24 v106.68,15.24
  Bottom 0.813: v81.28,15.24 DP3.7 | v93.98,15.24 DP2.7 | v106.68,15.24 DP1.7 106.68,24.13 107.95,25.4 107.95,31.75 107.95,32.39 R7.1
DB  (via drill 0.6 pad 1.78)
  Top 0.305: v83.82,13.97 v96.52,13.97 v109.22,13.97
  Bottom 0.813: v83.82,13.97 DP3.6 | v109.22,13.97 DP1.6 109.22,22.86 110.49,24.13 110.49,32.39 R8.1 | v96.52,13.97 DP2.6
DC  (via drill 0.6 pad 1.78)
  Top 0.305: v81.28,12.7 v93.98,12.7 v106.68,12.7 v118.11,12.7
  Bottom 0.813: DP3.4 v81.28,12.7 | v93.98,12.7 DP2.4 | v106.68,12.7 DP1.4 | v118.11,12.7 R9.1
DD  (via drill 0.6 pad 1.78)
  Top 0.305: v76.2,11.43 v88.9,11.43 v101.6,11.43 v115.57,11.43
  Bottom 0.813: DP3.2 v76.2,11.43 | v88.9,11.43 DP2.2 | v101.6,11.43 DP1.2 | v115.57,11.43 R10.1
DE  (via drill 0.6 pad 1.78)
  Top 0.305: v73.66,10.16 v86.36,10.16 v99.06,10.16 v113.03,10.16
  Bottom 0.813: DP3.1 v73.66,10.16 | v86.36,10.16 DP2.1 | v99.06,10.16 DP1.1 | v113.03,10.16 R11.1
DF  (via drill 0.6 pad 1.78)
  Top 0.305: v76.2,16.51 v88.9,16.51 v101.6,16.51
  Bottom 0.813: v76.2,16.51 DP3.9 | v88.9,16.51 DP2.9 | v101.6,16.51 DP1.9 101.6,24.13 100.33,25.4 R12.1
DG  (via drill 0.6 pad 1.78)
  Top 0.305: v73.66,17.78 v86.36,17.78 v99.06,17.78
  Bottom 0.813: v73.66,17.78 DP3.10 | v86.36,17.78 DP2.10 | v99.06,17.78 DP1.10 99.06,24.13 97.79,25.4 R13.1
E
  Bottom 0.813: R11.2 113.03,49.53 110.49,52.07 101.6,52.07 100.33,53.34 U2.15
F
  Bottom 0.406: 96.52,48.26 96.52,51.05
  Bottom 0.61: 96.52,51.05 96.52,52.58 97.79,53.85 U2.16
  Bottom 0.813: 96.52,48.26 96.52,47.5 97.03,46.99 99.06,46.99 100.33,45.72 R12.2
G
  Bottom 0.406: 93.98,48.26 93.98,51.05
  Bottom 0.61: U2.17 95.25,54.86 93.98,53.59 93.98,51.05
  Bottom 0.813: 93.98,48.26 93.98,47.5 97.03,44.45 R13.2
GATE
  Bottom 1.27: U3.3 133.35,41.91 Q2.G
  Bottom 2.184: Q2.G 127,40.64 R18.2
GND  (1 unrouted)
  Bottom 0.406: 25.15,62.23 27.43,62.23 28.45,63.25 37.59,63.25 | 88.9,47.75 88.9,50.8 | 91.44,50.8 91.44,47.75 91.44,46.99
  Bottom 0.61: 19.05,36.83 21.59,36.83 | 18.54,62.23 U1.4 | 88.9,47.75 88.9,44.45 90.17,43.18 90.17,38.35 | 106.05,32.39 104.78,33.66 | 85.09,46.99 U2.8 85.09,50.55 | 91.44,47.75 91.44,46.99 | 238.12,92.71 U5.A 238.12,90.17
  Bottom 0.813: C2.2 19.05,36.83 | U1.13 21.59,52.07 22.86,52.07 25.4,52.07 | U1.4 25.15,62.23 | C7.2 90.42,38.1 | 90.42,38.1 C6.2 | S1.2 S1.1 68.3,10.44 C5.2 | U2.19 90.17,53.34 90.17,52.07 | 90.42,38.1 90.17,38.35 | 85.09,50.55 86.61,52.07 90.17,52.07 | 21.59,36.83 23.11,36.83 | 27.94,51.31 31.75,52.07 | U1.1 17.78,66.04 16.51,64.77 16.51,63.5 17.78,62.23 18.54,62.23 | 91.44,50.8 91.44,52.07 90.17,52.07 | 88.9,50.8 88.9,52.07 | Q3.1 82.55,27.94 | Q4.1 95.89,28.58 95.89,33.02 92.71,36.2 | Q5.1 106.05,27.31 106.05,32.39 | 82.55,31.12 72.39,31.12 70.48,31.12 69.22,29.85
  Bottom 1.016: 26.67,52.07 22.86,52.07 | 27.69,51.31 27.94,51.31 38.1,51.31 38.61,50.8 39.88,50.8 | 39.88,50.8 39.99,50.8 | 39.99,50.8 40.01,50.82 | 39.99,50.8 39.99,48.29 40.01,48.28 | 39.88,50.8 40.64,50.8 | 40.64,50.8 41.4,50.8 | 41.4,50.8 42.42,50.8 | 42.42,50.8 44.2,54.61 | 41.4,48.26 42.42,48.26 | 40.64,48.26 41.4,48.26 | 40.64,48.26 40.13,48.26 | 42.42,48.26 42.93,48.26 | 42.42,50.8 42.42,48.26 | 41.4,48.26 41.4,50.55 | 41.4,50.8 41.4,50.55 | 41.4,50.8 41.4,50.55 | 40.64,50.8 40.64,48.26 | Q1.E 134.62,83.82 R16.1 | 104.78,33.66 103.5,34.93 103.5,36.2 | U5.A 238.12,91.44 240.03,91.44
  Bottom 1.27: 44.2,54.61 J3.3 | 63.5,35.56 R4.1
  Bottom 1.422: 11.43,25.4 11.43,26.67 17.78,26.67 17.78,24.13 11.43,24.13 11.43,25.4 | 26.67,52.07 25.4,52.07 | 26.67,46.99 26.67,52.07 | 26.67,52.07 31.75,52.07 27.94,51.31 27.94,45.72 R2.1 26.67,46.99 | C3.2 6.35,26.67 7.62,25.4 11.43,25.4 | 26.67,46.99 25.4,46.99 | 214.47,43.02 214.63,43.18 214.93,43.18 | T1.7 214.93,43.18 | 214.93,43.18 212.09,43.18
  Bottom 1.778: C9.2 C8.-
  Bottom 2.184: 214.47,43.02 T1.8
  pour Bottom (isolate 0.508): 0,100.33 0,0 115.57,0 120.65,3.56 120.65,55.88 123.44,59.18 138.94,59.18 140.97,61.72 140.97,91.19 146.3,96.52 191.77,96.52 198.12,88.9 198.12,40.64 226.06,40.64 226.06,76.2 228.6,78.74 246.38,78.74 248.92,82.55 249.05,100.33
IN1  (via drill 0.6 pad 1.68)
  Top 0.305: v33.53,47.5 v33.53,59.69
  Bottom 0.813: 35.58,43.2 36.83,43.2 | 36.83,43.2 40.01,43.2 | 35.58,43.2 RN1.4 | 35.58,43.2 34.53,43.2 33.53,44.2 v33.53,47.5 | U1.6 28.96,59.69 29.72,60.45 32,60.45 32.77,60.45 v33.53,59.69 | U2.4 74.93,46.48 74.93,42.93 73.66,41.66 64.01,41.66 43.43,41.66 41.91,43.18 36.84,43.18 36.83,43.2
IN2  (via drill 0.6 pad 1.68)
  Top 0.305: v37.08,60.96 v37.08,49.53
  Bottom 0.406: 73.66,48.01 73.66,51.05
  Bottom 0.61: U1.5 24.13,60.96
  Bottom 0.813: 36.83,45.74 35.58,45.74 | 36.83,45.74 40.01,45.74 42.91,45.74 45.21,43.43 61.21,43.43 72.14,43.43 73.66,44.96 73.66,48.01 | v37.08,49.53 37.08,47.24 37.08,45.99 36.83,45.74 | RN1.5 36.81,45.72 36.83,45.74 | 24.13,60.96 27.94,60.96 29.21,62.23 35.56,62.23 35.81,62.23 v37.08,60.96 | U2.5 77.47,51.56 76.71,52.32 74.42,52.32 73.66,51.56 73.66,51.05
IN3  (via drill 0.6 pad 1.42)
  Top 0.305: v71.12,38.1 v71.12,45.72
  Bottom 0.61: U1.23 24.38,38.1
  Bottom 0.813: 24.38,38.1 35.56,38.1 RN1.2 36.83,38.1 69.6,38.1 v71.12,38.1 | U2.3 72.39,46.99 v71.12,45.72
IN4  (via drill 0.6 pad 1.42)
  Top 0.305: v74.8,39.88 v82.55,39.88
  Bottom 0.813: 35.58,40.66 36.83,40.66 | 36.83,40.66 40.01,40.66 | 35.58,40.66 RN1.3 | 35.58,40.66 35.56,40.64 33.02,40.64 32,39.62 23.11,39.62 U1.22 | v82.55,39.88 U2.7 | v74.8,39.88 71.12,39.88 61.72,39.88 41.4,39.88 40.64,40.64 36.84,40.64 36.83,40.66
K0
  Bottom 0.406: 83.82,48.01 83.82,51.05 | 83.82,41.15 83.82,38.61 83.82,38.1
  Bottom 0.813: U2.21 85.09,52.83 83.82,51.56 83.82,51.05 | 83.82,41.15 83.82,48.01 | 83.82,38.1 83.82,36.83 85.09,35.56 90.17,35.56 R23.2
K1
  Bottom 0.406: 81.28,48.01 81.28,51.05 | 81.28,37.59 81.28,38.1 81.28,41.15
  Bottom 0.813: U2.22 82.55,52.83 81.53,51.82 81.28,51.56 81.28,51.05 | 81.28,41.15 81.28,48.01 | 81.28,37.59 81.28,38.1 81.28,35.56 78.74,33.02 R22.2
K2
  Bottom 0.406: 78.74,48.01 78.74,51.05
  Bottom 0.813: U2.23 80.01,53.09 78.74,51.82 78.74,51.05 | R21.2 66.04,30.48 66.04,31.75 69.85,35.56 74.93,35.56 75.56,35.56 77.47,37.47 77.47,41.91 77.47,46.36 78.11,46.99 78.74,47.63 78.74,48.01
N$1
  Bottom 0.813: DP3.3 DP3.8 Q3.3
N$2
  Bottom 0.813: DP2.3 DP2.8 91.44,22.86 Q4.3
N$3
  Bottom 0.813: DP1.3 DP1.8 | DP1.8 104.14,22.86 | Q5.3 102.87,25.4 104.14,24.13 DP1.8
N$4
  Bottom 1.27: R20.1 142.24,46.99 140.97,48.26 U3.4
N$5
  Bottom 0.813: Q5.2 R23.1
N$6
  Bottom 0.813: R22.1 87.63,30.48 90.81,30.48 Q4.2
N$7
  Bottom 2.184: Q2.T1 132.08,34.29 129.54,31.75 R18.1 L1.2
N$8
  Bottom 1.016: U3.2 133.35,64.77 R19.2
N$9
  Bottom 0.813: R21.1 79.38,29.21 Q3.2
N$10
  Bottom 1.016: Q1.C 132.08,71.12 R19.1
N$11
  Bottom 1.016: R17.1 125.73,73.66 Q1.B
N$14  (1 unrouted)
  Bottom 2.184: F2.2A 172.47,72.64 171.45,74.93 171.45,87.63 | 171.45,87.63 173.99,90.17 | 171.45,87.63 173.99,90.17 | 171.45,87.63 173.99,90.17 | 173.99,90.17 L2.1 | 173.99,67.31 173.99,72.39
N$25
  Bottom 1.016: U6.2 229.87,77.47 231.14,76.2 238.76,76.2 R27.1
N$27
  Bottom 1.016: R29.2 R28.2 R29.2 | R29.2 U6.3
N$30
  Bottom 1.016: U5.C 234.95,88.9 236.22,87.63 C14.2 R27.2
N$31
  Bottom 1.016: R25.1 R26.2 231.14,96.52 232.41,95.25 | 232.41,95.25 U5.R | 232.41,95.25 C14.1
N$33
  Bottom 1.422: D7.A1 218.44,43.67 T1.6
N$35  (via drill 0.6 pad 1.78)
  Top 0.406: v180.34,6.35 v190.5,6.35
  Bottom 2.184: R36.1 v180.34,6.35 | v190.5,6.35 193.04,6.35 C20.2 D6.C
N$36
  Bottom 1.422: T1.3 217.09,17.86 D5.A
N$37
  Bottom 1.422: D7.A2 223.52,43.45 T1.5
N$38
  Bottom 1.422: D8.A1 200.66,43.45 T1.10
N$39
  Bottom 1.422: D8.A2 205.74,43.67 T1.9
NTC  (via drill 0.6 pad 1.78)
  Top 0.305: v55.88,27.94 v55.88,45.72
  Bottom 0.813: v55.88,45.72 R4.2 68.58,45.72 69.85,46.99 U2.2 | C11.1 v55.88,27.94
  Bottom 1.27: J2.2 34.29,13.97 35.56,15.24 35.56,25.4 38.1,27.94 C11.1 v55.88,27.94
OUT1  (via drill 0.6 pad 1.68)
  Top 0.305: v12.7,54.61 v16.51,54.61
  Bottom 1.016: U1.9 17.78,55.88 v16.51,54.61
  Bottom 1.422: J1.1 8.25,52.7 10.16,54.61 v12.7,54.61
OUT2  (via drill 0.6 pad 1.68)
  Top 0.305: v12.7,50.8 v16.51,50.8
  Bottom 1.016: U1.11 19.05,53.34 v16.51,50.8
  Bottom 1.422: J1.2 12.6,50.7 v12.7,50.8
OUT3  (via drill 0.6 pad 1.68)
  Top 0.305: v12.7,46.99 v16.51,46.99
  Bottom 1.016: v16.51,46.99 17.78,46.99 19.05,48.26 U1.15
  Bottom 1.422: J1.3 10.99,48.7 v12.7,46.99
OUT4  (via drill 0.6 pad 1.68)
  Top 0.305: v12.7,43.18 v16.51,43.18
  Bottom 1.016: v16.51,43.18 U1.19
  Bottom 1.422: J1.4 8.01,45.33 10.16,43.18 11.43,43.18 | 11.43,43.18 v12.7,43.18 | 11.43,43.18 v12.7,43.18 | 11.43,43.18 v12.7,43.18
PGC
  Bottom 0.813: U2.27 69.85,58.42 68.58,59.69 J3.5
PGD
  Bottom 1.016: J3.4 U2.28
PGM
  Bottom 0.813: U2.24 R5.2
PWR_16VCC
  Bottom 1.016: C18.+ 240.66,33.02 238.76,31.12 231.78,31.12 | C19.1 232.41,31.75 231.78,31.12 | 231.78,31.12 231.14,30.48 228.6,27.94 R24.1 227.33,19.05 D5.C
  Bottom 1.422: U4.7 238.76,35.56 C18.+
PWR_AC1
  Bottom 2.184: L2.2 179.07,80.01 180.34,80.01 181.61,78.74 181.61,57.28 181.61,50.8 | 181.61,50.8 180.34,49.53 D4.AC1 | C12.1 181.74,52.2 181.61,50.8
PWR_AC2
  Bottom 1.422: D4.AC2 185.42,47.63 186.06,48.26 186.69,48.9 189.87,48.9 191.13,50.17 191.13,71.76 188.59,74.3 188.47,74.3 C12.2
  Bottom 2.184: C12.2 187.96,79.88 L2.3 VZ2.2
PWR_COMP
  Bottom 1.016: C15.1 241.3,49.53 R30.2 U4.1
PWR_D_FET  (via drill 1.1 pad 3.81)
  Bottom 1.422: v208.91,12.7 Q6.D
  Bottom 1.778: D6.A v208.91,12.7
  Bottom 2.184: T1.2 207.09,14.53 v208.91,12.7
PWR_FET_OUT
  Bottom 1.016: R33.2 U4.6
PWR_G_FET
  Bottom 1.422: 206.38,4.45 Q6.G 206.38,4.45 | 207.01,3.81 206.38,4.45 | 207.01,3.81 206.38,4.45 | 207.01,3.81 236.22,3.81 237.49,5.08 237.49,11.43 | 237.49,11.43 237.49,22.86 R33.1 | 237.49,11.43 R34.2
PWR_ISENSE  (via drill 0.6 pad 1.78)
  Top 0.406: v245.11,20.32 v245.11,42.55
  Bottom 1.016: U4.3 236.22,43.82 237.49,42.55 242.57,42.55 243.21,42.55 243.84,42.55 v245.11,42.55 | C17.1 v245.11,20.32 245.11,17.78 R32.2
PWR_RTCT
  Bottom 1.016: R31.1 231.14,48.26 232.41,46.99 | 232.41,46.99 U4.4 | 232.41,46.99 C16.1
PWR_S_FET
  Bottom 1.422: Q6.S R35.2 228.6,7.62 R34.1 R32.1
PWR_VFB
  Bottom 1.016: U4.2 238.76,48.26 234.95,52.07 234.95,55.88 C15.2
  Bottom 1.422: C15.2 R30.1 242.57,59.69 242.57,66.04 241.3,67.31 R29.1
PWR_VNEG
  Bottom 2.184: TH1.2 D4.-
PWR_VREF
  Bottom 1.016: U4.8 241.3,40.01 240.66,40.64 231.78,40.64 229.87,40.64 229.55,40.32 | R31.2 229.87,40.01 229.55,40.32 | U6.4 232.41,62.23 229.87,59.69 228.6,58.42 228.6,50.8 227.97,49.53 227.97,41.91 229.55,40.32
SA  (via drill 0.6 pad 1.68)
  Top 0.305: v26.67,54.61 v26.67,63.5
  Bottom 0.61: 24.13,63.5 21.59,63.5
  Bottom 0.813: 21.59,63.5 U1.3 | v26.67,63.5 24.13,63.5
  Bottom 1.016: U1.10 v26.67,54.61
  Bottom 1.422: R1.2 27.94,54.61 v26.67,54.61
SB  (via drill 0.6 pad 1.68)
  Top 0.305: v26.67,31.75 v26.67,43.94
  Bottom 1.016: U1.26 25.4,31.75 v26.67,31.75 | U1.18 26.16,44.45 v26.67,43.94
  Bottom 1.422: v26.67,31.75 27.94,31.75 R2.2
START_STOP  (via drill 0.6 pad 1.78)
  Top 0.305: v63.5,26.67 v63.5,54.61
  Bottom 0.813: S1.4 S1.3 68.3,14.96 C5.1 R14.1 68.58,21.59 D3.A v63.5,26.67 | U2.25 74.93,55.88 73.66,54.61 v63.5,54.61
VDD
  Bottom 1.016: D2.A 55.88,53.34 54.61,52.07 J3.2
VDD_MICRO  (via drill 0.6 pad 1.78)
  Top 0.305: v59.69,66.04 v59.69,73.66 | v87.63,73.66 v87.63,66.04
  Bottom 0.813: v87.63,66.04 U2.20
  Bottom 1.27: D2.C R6.2 v59.69,66.04 | C9.1 85.09,76.2 v87.63,73.66 | D1.C 69.85,76.2 67.31,73.66 v59.69,73.66
  Bottom 1.778: C9.1 C8.+ 82.55,86.36 78.74,82.55 D1.C
VPP
  Bottom 1.016: J3.1 59.69,49.53 | 59.69,49.53 U2.1 | 59.69,49.53 R6.1
XTAL1
  Bottom 0.813: U2.9 87.63,43.31 X1.2 86.36,41.78 C7.1
XTAL2
  Bottom 0.813: U2.10 90.17,45.59 X1.1 93.98,41.78 C6.1
(copper drawn outside any net)
  shapes: Bottom area x2

### Text on the board
Bottom: LAMINADORA PCB
tPlace: AC INPUT | SWITCH | LAMINADORA PCB | by Robson Martins | http://www.robsonmartins.com | PIC16F870 | PGC | PGD | STEPPER MOTOR | GND | VDD | 10A x 125V | 2.5A x 125V | VPP | ICSP | START / STOP | NTC | TEMPERATURE (°C) | FUSER